# Altium schematic sheet microprocesador.SchDoc
size A4
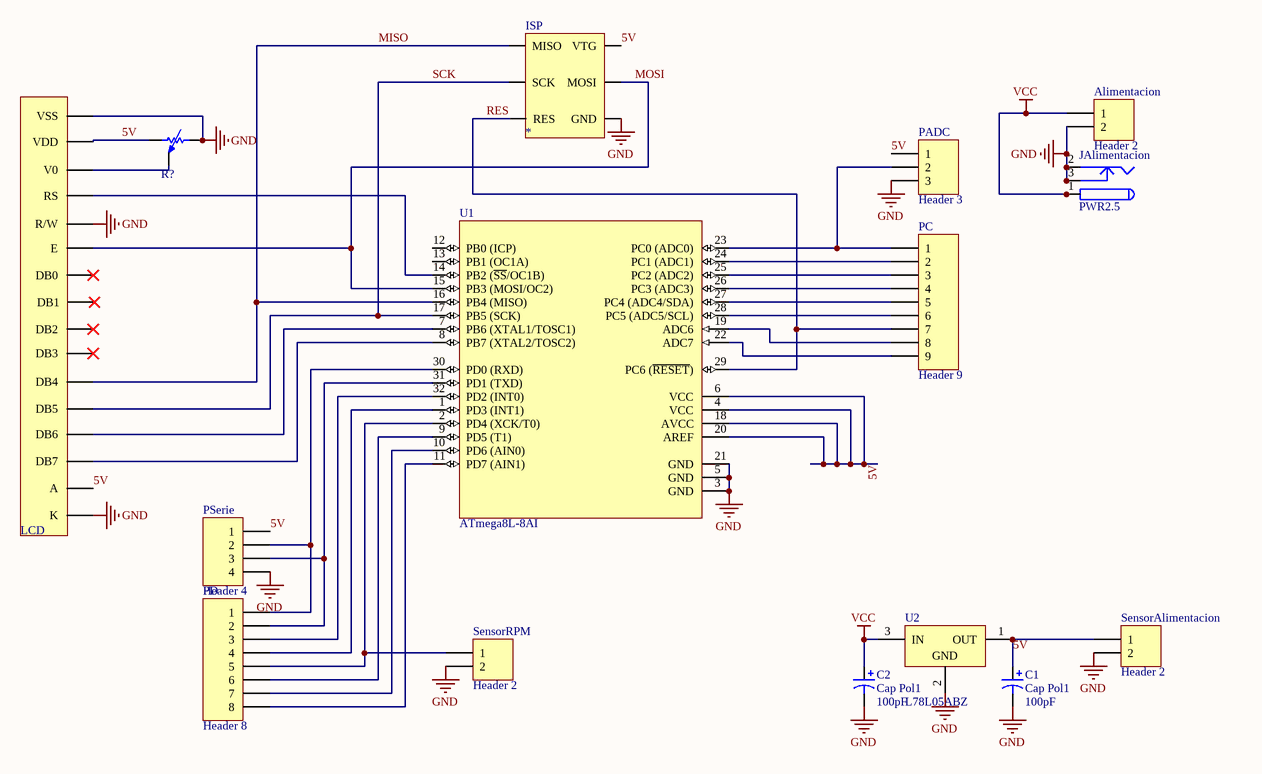
[diagram p0: microprocesador.SchDoc]

## Parts
Alimentacion  Header 2  [HDR1X2]
C1  Cap Pol1  value 100pF  [B]
C2  Cap Pol1  value 100pF  [B]
ISP  *  [AVR_ISP]
JAlimentacion  PWR2.5  [KLD-0202]
LCD  LCD  [LCD]  (value not drawn)
PADC  Header 3  [HDR1X3]
PC  Header 9  [HDR1X9]
PD  Header 8  [HDR1X8]
PSerie  Header 4  [HDR1X4]
R?  Pot  [Potenciometro]  (value not drawn)
SensorAlimentacion  Header 2  [HDR1X2]
SensorRPM  Header 2  [HDR1X2]
U1  ATmega8L-8AI  [32A]
U2  L78L05ABZ  [TO92]

## Nets
GND: Alimentacion.2 C1.2 C2.2 ISP.5(GND) JAlimentacion.2 JAlimentacion.2A JAlimentacion.2B JAlimentacion.3 JAlimentacion.3A JAlimentacion.3B LCD.0(VSS) LCD.4(R/W) LCD.15(K) PADC.3 PSerie.4 R?.1 SensorAlimentacion.2 SensorRPM.2 U1.3(GND) U1.5(GND) U1.21(GND) U2.2(GND)
VCC: Alimentacion.1 C2.1 JAlimentacion.1 JAlimentacion.1A JAlimentacion.1B U2.3(IN)
5V: C1.1 ISP.1(VTG) LCD.1(VDD) LCD.14(A) PADC.1 PSerie.1 R?.2 SensorAlimentacion.1 U1.4(VCC) U1.6(VCC) U1.18(AVCC) U1.20(AREF) U2.1(OUT)
MISO: ISP.0(MISO) LCD.10(DB4) U1.16(PB4_(MISO))
MOSI: ISP.3(MOSI) LCD.5(E) U1.15(PB3_(MOSI/OC2))
RES: ISP.4(RES) PC.7 U1.29(PC6_(~{RESET}))
SCK: ISP.2(SCK) LCD.11(DB5) U1.17(PB5_(SCK))
NetLCD_2: LCD.2(V0) R?.3
NetLCD_3: LCD.3(RS) U1.14(PB2_(~{SS}/OC1B))
NetLCD_12: LCD.12(DB6) U1.7(PB6_(XTAL1/TOSC1))
NetLCD_13: LCD.13(DB7) U1.8(PB7_(XTAL2/TOSC2))
NetPADC_2: PADC.2 PC.1 U1.23(PC0_(ADC0))
NetPC_2: PC.2 U1.24(PC1_(ADC1))
NetPC_3: PC.3 U1.25(PC2_(ADC2))
NetPC_4: PC.4 U1.26(PC3_(ADC3))
NetPC_5: PC.5 U1.27(PC4_(ADC4/SDA))
NetPC_6: PC.6 U1.28(PC5_(ADC5/SCL))
NetPC_8: PC.8 U1.19(ADC6)
NetPC_9: PC.9 U1.22(ADC7)
NetPD_1: PD.1 PSerie.2 U1.30(PD0_(RXD))
NetPD_2: PD.2 PSerie.3 U1.31(PD1_(TXD))
NetPD_3: PD.3 U1.32(PD2_(INT0))
NetPD_4: PD.4 U1.1(PD3_(INT1))
NetPD_5: PD.5 SensorRPM.1 U1.2(PD4_(XCK/T0))
NetPD_6: PD.6 U1.9(PD5_(T1))
NetPD_7: PD.7 U1.10(PD6_(AIN0))
NetPD_8: PD.8 U1.11(PD7_(AIN1))

Not connected (* = marked no-connect by the designer): LCD 6(DB0)* 7(DB1)* 8(DB2)* 9(DB3)*; U1 12(PB0_(ICP)) 13(PB1_(OC1A))

## Library data of the parts
Alimentacion SensorAlimentacion SensorRPM = Header 2: Header, 2-Pin; LatestRevisionDate: 17-Jul-2002; LatestRevisionNote: Re-released for DXP Platform.; Publisher: Altium Limited
C1 C2 = Cap Pol1: Polarized Capacitor (Radial); Published: 8-Jun-2000; LatestRevisionDate: 17-Jul-2002; LatestRevisionNote: Re-released for DXP Platform.; PackageReference: RB7.6-15; Publisher: Altium Limited
ISP = AVR_ISP
JAlimentacion = PWR2.5: Low Voltage Power Supply Connector; Published: 17-Dec-2003; DatasheetDocument: 09-May-2002; Publisher: Altium Limited; ComponentLink1Description: Manufacturer Link; ComponentLink1URL: http://domino.kycon.com/internet/Products.html
PADC = Header 3: Header, 3-Pin; LatestRevisionDate: 17-Jul-2002; LatestRevisionNote: Re-released for DXP Platform.; Publisher: Altium Limited
PC = Header 9: Header, 9-Pin; LatestRevisionDate: 17-Jul-2002; LatestRevisionNote: Re-released for DXP Platform.; Publisher: Altium Limited
PD = Header 8: Header, 8-Pin; LatestRevisionDate: 17-Jul-2002; LatestRevisionNote: Re-released for DXP Platform.; Publisher: Altium Limited
PSerie = Header 4: Header, 4-Pin; LatestRevisionDate: 17-Jul-2002; LatestRevisionNote: Re-released for DXP Platform.; Publisher: Altium Limited
U1 = ATmega8L-8AI: 8-Bit AVR Microcontroller with 8K Bytes of In-System Programmable Flash Memory; PackageDocument: revB, Oct-2001; Published: 17-Sep-2003; LatestRevisionDate: 4-Mar-2005; LatestRevisionNote: Stylized 3D Model Added.; DatasheetDocument: 2486H-AVR-09/02; PackageReference: 32A; Publisher: Altium Limited; Code_JEDEC: MS-026-ABA; ComponentLink1Description: Manufacturer Link; ComponentLink1URL: http://www.atmel.com; ComponentLink2Description: Datasheet; ComponentLink2URL: http://www.atmel.com/dyn/resources/prod_documents/doc2486.pdf
U2 = L78L05ABZ: Positive Voltage Regulator; Published: 24-Aug-2001; LatestRevisionDate: 17-Jul-2002; LatestRevisionNote: Re-released for DXP Platform.; DatasheetDocument: Feb-1999; PackageReference: TO92; Publisher: Altium Limited; ComponentLink1Description: Manufacturer Link; ComponentLink1URL: http://www.st.com/